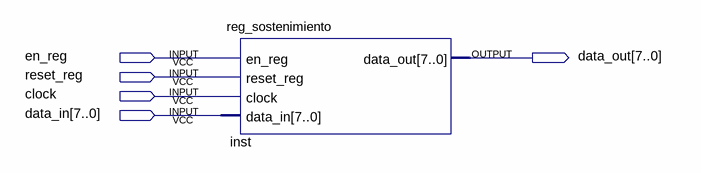
[diagram p0: schematic sheet]
// Quartus schematic prueba_sost.bdf as structural Verilog: 1 symbols, 5 pins
module prueba_sost (
  input  en_reg,
  input  reset_reg,
  input  clock,
  input  [7:0] data_in,
  output [7:0] data_out
);

  reg_sostenimiento inst (
    .en_reg(en_reg), .reset_reg(reset_reg), .clock(clock), .data_in(data_in), .data_out(data_out));
endmodule
